# Altium schematic sheet Voltage_supply.SchDoc: Power Supply
size A4; Author: Johan Vårlid; SheetNumber: 3; SheetTotal: 3
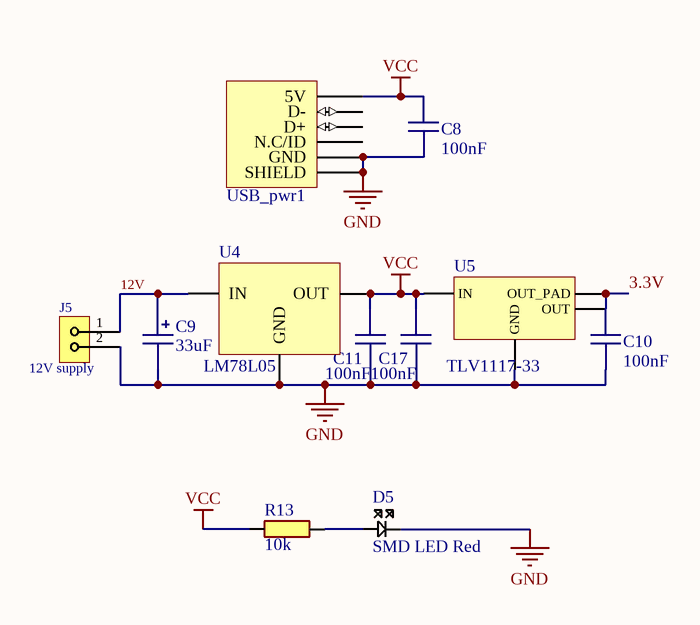
[diagram p0: Voltage_supply.SchDoc]

## Parts
C8  100nF  [CAPC0603(1608)55_N]
C9  33uF  [CAPPR20D05H11]
C10  100nF  [CAPC0603(1608)55_N]
C11  100nF  [CAPC0603(1608)55_N]
C17  100nF  [CAPC0603(1608)55_N]
D5  SMD LED Red  [I_LEDC0603(1608)_N]
J5  12V supply  [FCI-20020110-C021A01LF]
R13  10k  [RESC0603(1608)_N]
U4  LM78L05  [TO-220-3P]
U5  TLV1117-33  [SOT230P700X180-4N]
USB_pwr1  USB_CONNECTOR_5P  [105017-0001]  (value not drawn)

## Nets
2: U4.4
GND: C8.1 C9.1 C10.1 C11.1 C17.1 D5.2 J5.2 U4.2(GND) U5.1(GND) USB_pwr1.0(SHIELD) USB_pwr1.5(GND)
VCC: C8.2 C11.2 C17.2 R13.1 U4.3(OUT) U5.3(IN) USB_pwr1.1(5V)
3.3V: C10.2 U5.2(OUT_PAD) U5.4(OUT)
12V: C9.2 J5.1 U4.1(IN)
NetD5_1: D5.1 R13.2

Not connected (* = marked no-connect by the designer): USB_pwr1 2(D-) 3(D+) 4(N.C/ID)

## Notes on the sheet
- Size:
- Date:
- Title:
- A3
- Revision:
- Sheet
- of
- Author:
- File:

## Library data of the parts
C8 C10 C11 C17 = 3028: X7R 50V 5%; id: 3028; pakke_opprettet_av: 815; leverandor_varenr: 1759122; pris: 1; nokkelord: Kondensator, Capacitor, CAP; produsent: Multikomp; leverandor: Farnell; pakketype: 0603; pakke_opprettet: 18.02.2015 14:18:13; symbol_opprettet_av: 815; symbol_opprettet: 14.11.2014 20:19:34; navn: 100nF
C9 = 3290: 50V, Elektrolytt; id: 3290; rad: 6; rom: OV; lager_type: Fremlager; dybde: 3; hylle: 7; antall: 120; kolonne: 1; pakke_opprettet_av: 1335; pakke_opprettet: 13.11.2016 14.55.27; symbol_opprettet_av: 815; symbol_opprettet: 28.06.2014 15.26.13; leverandor_varenr: 1834148; nokkelord: Kondensator, capacitor, Elektrolytt; produsent: vishay; leverandor: Farnell; pakketype: TH; navn: 33uF; pris: 1
D5 = 2209: id: 2209; rad: 0; rom: OV; lager_type: Fremlager; dybde: 2; hylle: 6; antall: 50; pakke_opprettet_av: 815; pakke_opprettet: 06.07.2014 18.55.44; symbol_opprettet: 06.07.2014 18.59.47; leverandor_varenr: 8554641; pris: 1; produsent: Avago; leverandor: Farnell; pakketype: 0603; kolonne: 0; symbol_opprettet_av: 815; beskrivelse: SMD; navn: SMD LED Red; nokkelord: SMD
J5 = 2218: id: 2218; pakke_opprettet_av: 815; pakke_opprettet: 13.11.2014 14.07.06; symbol_opprettet: 13.11.2014 10.58.53; beskrivelse: Skruplint; leverandor_varenr: 1787816; navn: Pluggbar skrukobling x2; pris: 3; produsent: FCI; leverandor: Farnell; pakketype: TH; symbol_opprettet_av: 815
R13 = 2444: 0.1W 1% Thick film resistor; id: 2444; rad: 21; rom: GM; lager_type: Baklager; dybde: 1; hylle: 0; antall: 3500; pakke_opprettet_av: 815; pakke_opprettet: 08.07.2014 21.15.30; symbol_opprettet: 08.07.2014 21.16.33; leverandor_varenr: 2447230; nokkelord: Resistor Motstand; produsent: Multikomp; leverandor: Farnell; pakketype: 0603; kolonne: 0; symbol_opprettet_av: 815; navn: 10k; pris: 0
U4 = 1429: Voltage Regulator; id: 1429; rad: 23; rom: GM; lager_type: Baklager; dybde: 41; hylle: 0; antall: 200; pakke_opprettet_av: 815; pakke_opprettet: 09.06.2015 21.08.41; symbol_opprettet: 20.06.2015 13.45.33; pris: 4; pakketype: TH; kolonne: 0; symbol_opprettet_av: 815; navn: LM78L05
U5 = 2386: 3,3V Low dropout regulator; id: 2386; rad: 1; rom: GM; lager_type: Baklager; dybde: 8; hylle: 0; pakke_opprettet_av: 774; pakke_opprettet: 11.07.2014 22.00.23; symbol_opprettet: 11.07.2014 22.01.42; leverandor_varenr: 2447986; pris: 5; nokkelord: ldo; produsent: Texas Instruments; leverandor: Farnell; pakketype: SOT; antall: 0; kolonne: 0; symbol_opprettet_av: 774; navn: TLV1117-33
USB_pwr1 = 4034: Micro USB Type B; id: 4034; pakke_opprettet_av: 1335; pakke_opprettet: 21.02.2017 23.55.20; symbol_opprettet_av: 924; symbol_opprettet: 30.07.2015 18.06.06; leverandor_varenr: 2293836; navn: USB Micro; pris: 0; nokkelord: USB Connector, Micro USB Type B, USB 2.0, Receptacle, 5 Ways, Surface Mount, Right Angle; leverandor: Farnell; pakketype: SMD